# Altium schematic sheet OLED_Board.SchDoc
size A4; DocumentNumber: 1; SheetNumber: 1; SheetTotal: 1
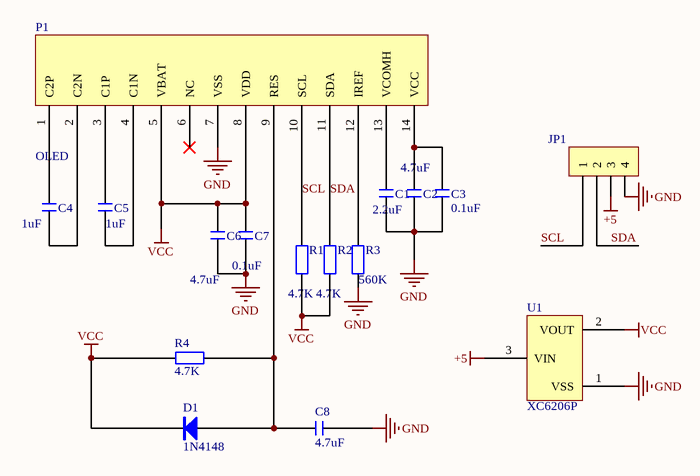
[diagram p0: OLED_Board.SchDoc]

## Parts
C1  2.2uF  [C 0603_L]
C2  4.7uF  [C 0603_L]
C3  0.1uF  [C 0603_L]
C4  1uF  [C 0603_L]
C5  1uF  [C 0603_L]
C6  4.7uF  [C 0603_L]
C7  0.1uF  [C 0603_L]
C8  4.7uF  [C 0603_L]
D1  1N4148  [MINI_MELF (LL34)]
JP1  HDR-1X4  [XH2.54-LI-4P]  (value not drawn)
P1  OLED  [OLED]
R1  4.7K  [R 0603_L]
R2  4.7K  [R 0603_L]
R3  560K  [R 0603_L]
R4  4.7K  [R 0603_L]
U1  XC6206P  [SOT23-3M]

## Nets
+5: JP1.3 U1.3(VIN)
GND: C1.1 C2.1 C3.1 C6.1 C7.1 C8.2 JP1.4 P1.7(VSS) R3.1 U1.1(VSS)
VCC: C6.2 C7.2 D1.2(K) P1.5(VBAT) P1.8(VDD) R1.1 R2.1 R4.1 U1.2(VOUT)
SCL: JP1.1 P1.10(SCL) R1.2
SDA: JP1.2 P1.11(SDA) R2.2
NetC1_2: C1.2 P1.13(VCOMH)
NetC2_2: C2.2 C3.2 P1.14(VCC)
NetC4_1: C4.1 P1.2(C2N)
NetC4_2: C4.2 P1.1(C2P)
NetC5_1: C5.1 P1.4(C1N)
NetC5_2: C5.2 P1.3(C1P)
NetC8_1: C8.1 D1.1(A) P1.9(RES) R4.2
NetP1_12: P1.12(IREF) R3.2

Not connected (* = marked no-connect by the designer): P1 6(NC)*

## Library data of the parts
C1-C8 = C: 无极性贴片电容; 材质: X7R; BOM名称: 无极性贴片电容
D1 = 1N4148: 高速开关二极管; BOM名称: 高速开关二极管
JP1 = Header 4: 4P接插件; BOM名称: 4P接插件
R1-R4 = R: 贴片电阻; BOM名称: 贴片电阻